# EAGLE design tinker (EAGLE 9.3.1)
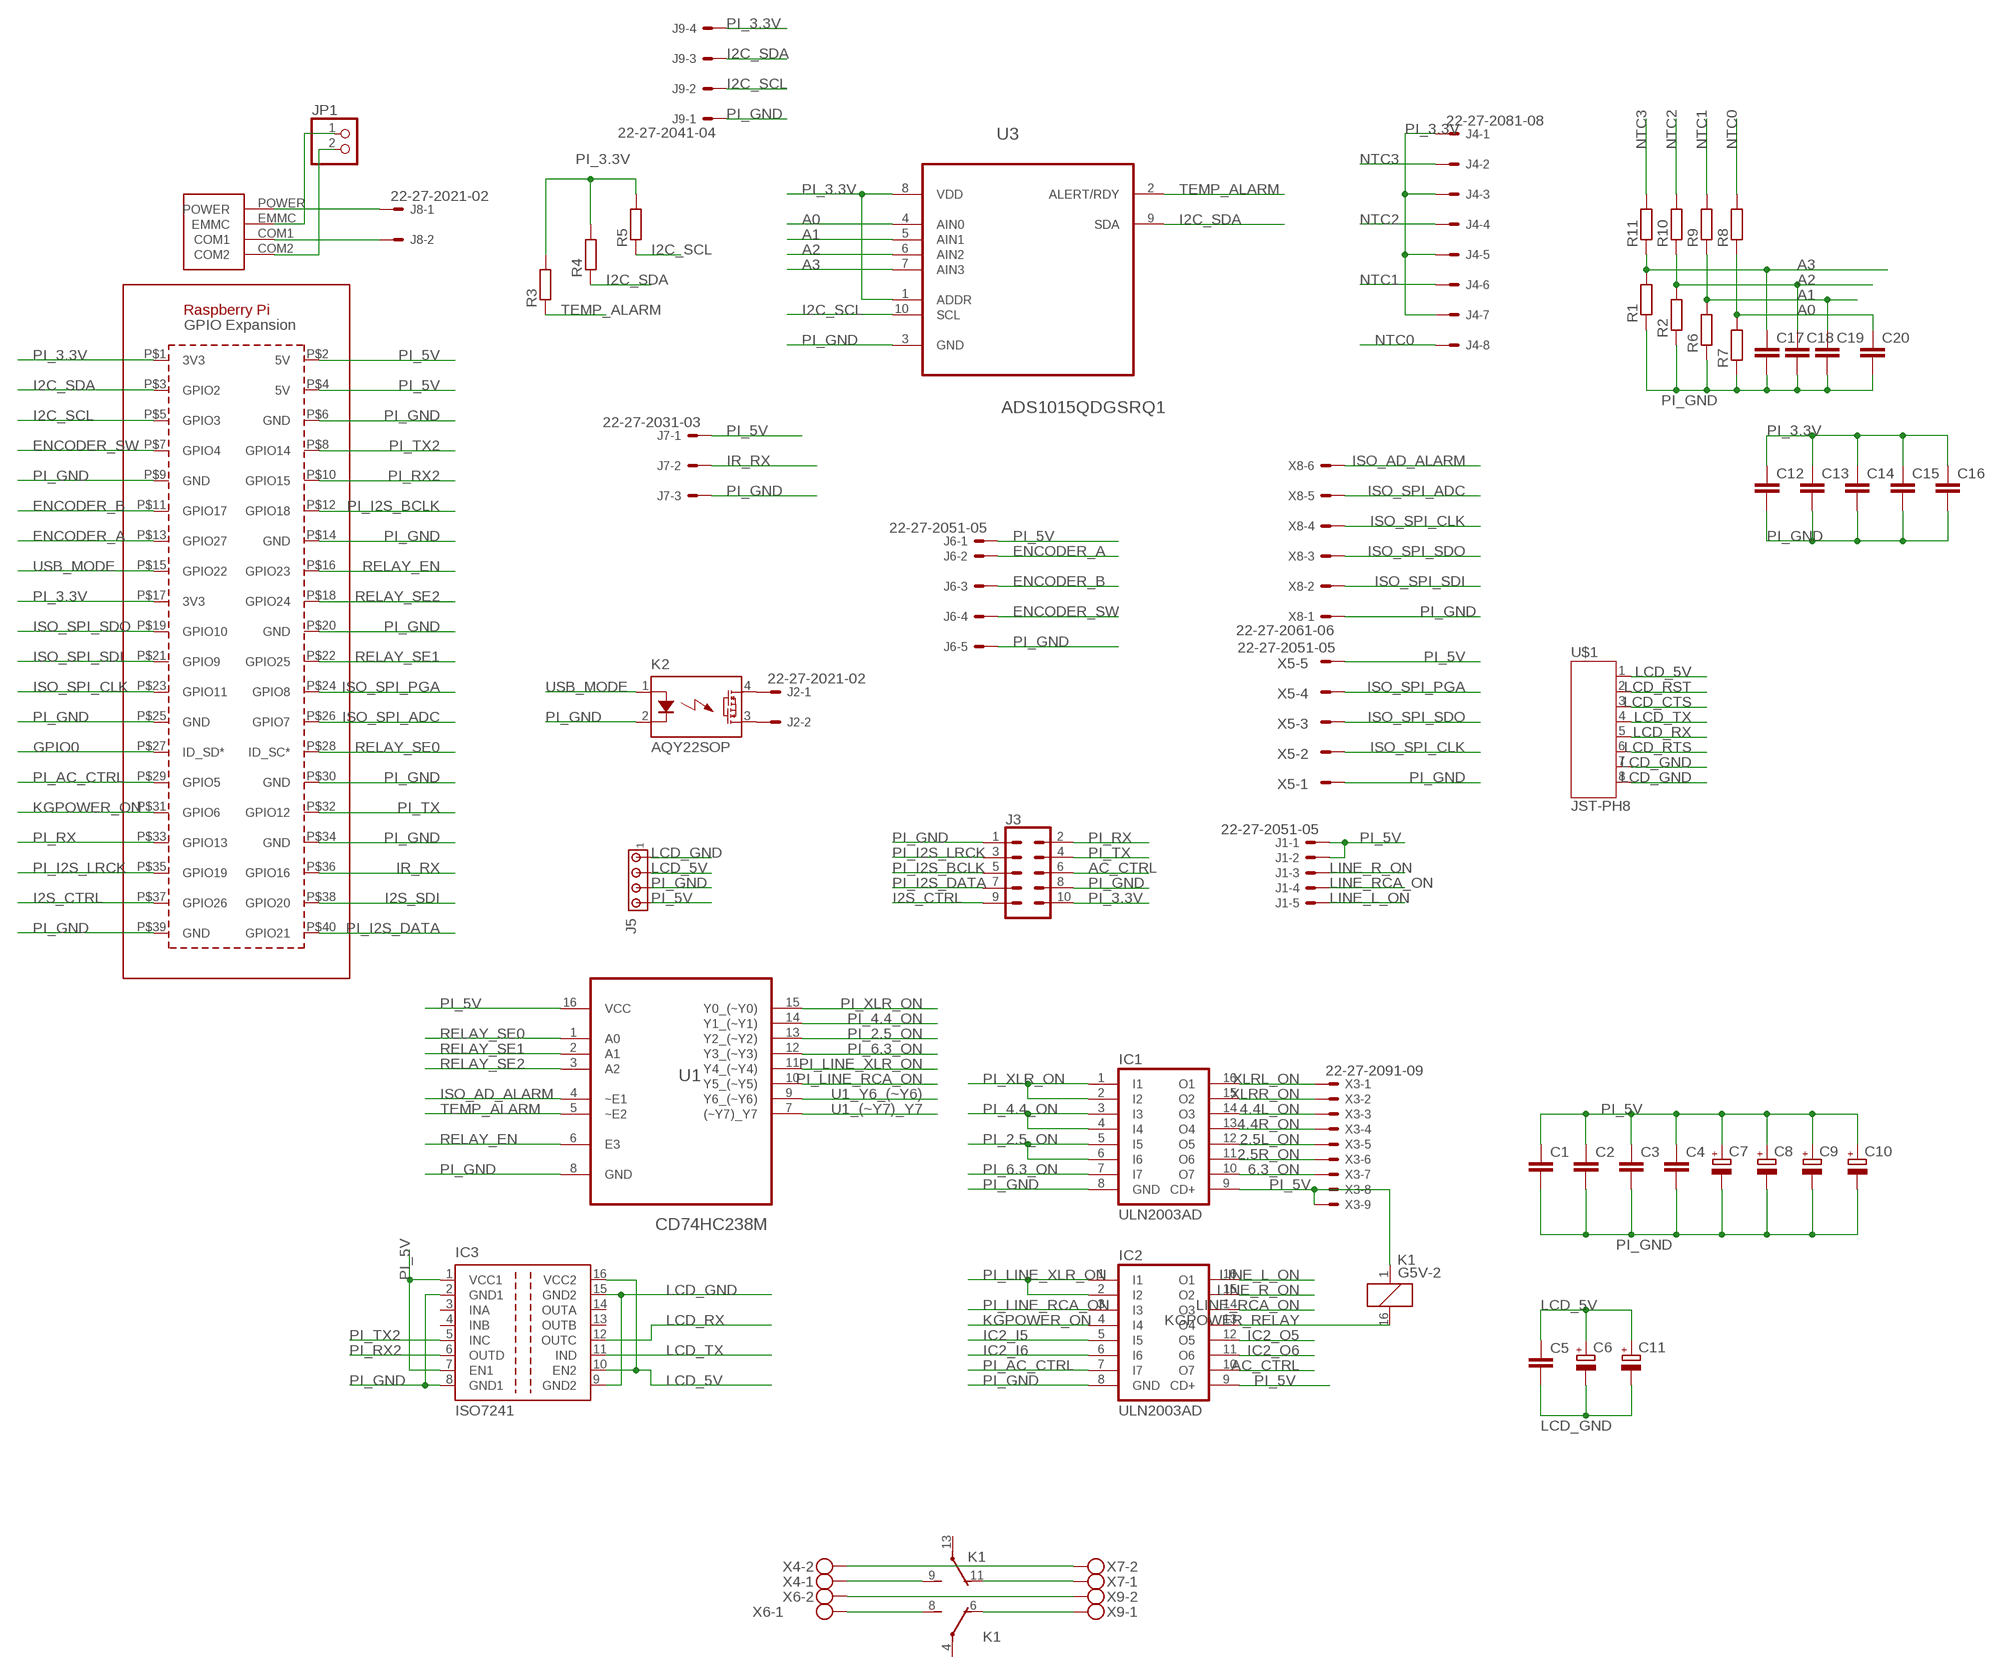
[diagram p0: schematic, sheet 1]

## Parts
C1  C-EUC0603  [C0603]
C2  C-EUC0603  [C0603]
C3  C-EUC0603  [C0603]
C4  C-EUC0603  [C0603]
C5  C-EUC0603  [C0603]
C6  CPOL-EUSP-CAP-CX  [SP-CAP-CX]
C7  CPOL-EUE5-10.5  [E5-10,5]
C8  CPOL-EUE5-10.5  [E5-10,5]
C9  CPOL-EUE5-10.5  [E5-10,5]
C10  CPOL-EUE5-10.5  [E5-10,5]
C11  CPOL-EUSP-CAP-CX  [SP-CAP-CX]
C12  C-EUC0603  [C0603]
C13  C-EUC0603  [C0603]
C14  C-EUC0603  [C0603]
C15  C-EUC0603  [C0603]
C16  C-EUC0603  [C0603]
C17  C-EUC0603  [C0603]
C18  C-EUC0603  [C0603]
C19  C-EUC0603  [C0603]
C20  C-EUC0603  [C0603]
IC1  ULN2003AD  [SO16]
IC2  ULN2003AD  [SO16]
IC3  ISO7241  [SO-16DW]
J1  22-27-2051-05  [6410-05]
J2  22-27-2021-02  [6410-02]
J3  CONN_05X2SHD_LOCK  [2X5-SHROUDED_LOCK]
J4  22-27-2081-08  [6410-08]
J5  MTA04-156  [1X4MTA]
J6  22-27-2051-05  [6410-05]
J7  22-27-2031-03  [6410-03]
J8  22-27-2021-02  [6410-02]
J9  22-27-2041-04  [6410-04]
JP1  PINHD-1X2  [1X02]
K1  G5V-2  [G5V-2]
K2  AQY22SOP  [SOP04]
PCB1  RPI3  [RPI3]
R1  R-EU_MELF0204W  [MINI_MELF-0204W]
R2  R-EU_MELF0204W  [MINI_MELF-0204W]
R3  R-EU_MELF0204W  [MINI_MELF-0204W]
R4  R-EU_MELF0204W  [MINI_MELF-0204W]
R5  R-EU_MELF0204W  [MINI_MELF-0204W]
R6  R-EU_MELF0204W  [MINI_MELF-0204W]
R7  R-EU_MELF0204W  [MINI_MELF-0204W]
R8  R-EU_MELF0204W  [MINI_MELF-0204W]
R9  R-EU_MELF0204W  [MINI_MELF-0204W]
R10  R-EU_MELF0204W  [MINI_MELF-0204W]
R11  R-EU_MELF0204W  [MINI_MELF-0204W]
U1  CD74HC238M  [SOIC127P600X175-16N]
U3  ADS1015QDGSRQ1  [SOP50P490X110-10N]
U$1  JST-PH8  [JST-PH8]
X3  22-27-2091-09  [6410-09]
X4  CON-PHOENIX-508_MKDSN1,5/2-5,08  [CON-PHOENIX-508_MKDSN1,5/2-5,08]
X5  22-27-2051-05  [6410-05]
X6  CON-PHOENIX-508_MKDSN1,5/2-5,08  [CON-PHOENIX-508_MKDSN1,5/2-5,08]
X7  CON-PHOENIX-508_MKDSN1,5/2-5,08  [CON-PHOENIX-508_MKDSN1,5/2-5,08]
X8  22-27-2061-06  [6410-06]
X9  CON-PHOENIX-508_MKDSN1,5/2-5,08  [CON-PHOENIX-508_MKDSN1,5/2-5,08]

## Nets
2.5L_ON: IC1.12(O5) X3.5
2.5R_ON: IC1.11(O6) X3.6
4.4L_ON: IC1.14(O3) X3.3
4.4R_ON: IC1.13(O4) X3.4
6.3_ON: IC1.10(O7) X3.7
A0: C20.1 R7.2 R8.1 U3.4(AIN0)
A1: C19.1 R6.2 R9.1 U3.5(AIN1)
A2: C18.1 R2.2 R10.1 U3.6(AIN2)
A3: C17.1 R1.2 R11.1 U3.7(AIN3)
AC_CTRL: IC2.10(O7) J3.6
ENCODER_A: J6.2 PCB1.P$13(GPIO27)
ENCODER_B: J6.3 PCB1.P$11(GPIO17)
ENCODER_SW: J6.4 PCB1.P$7(GPIO4)
GPIO0: PCB1.P$27(ID_SD*)
I2C_SCL: J9.2 PCB1.P$5(GPIO3) R5.1 U3.10(SCL)
I2C_SDA: J9.3 PCB1.P$3(GPIO2) R4.1 U3.9(SDA)
I2S_CTRL: J3.9 PCB1.P$37(GPIO26)
I2S_SDI: PCB1.P$38(GPIO20)
IC2_I5: IC2.5(I5)
IC2_I6: IC2.6(I6)
IC2_O5: IC2.12(O5)
IC2_O6: IC2.11(O6)
IR_RX: J7.2 PCB1.P$36(GPIO16)
ISO_AD_ALARM: U1.4(~E1) X8.6
ISO_SPI_ADC: PCB1.P$26(GPIO7) X8.5
ISO_SPI_CLK: PCB1.P$23(GPIO11) X5.2 X8.4
ISO_SPI_PGA: PCB1.P$24(GPIO8) X5.4
ISO_SPI_SDI: PCB1.P$21(GPIO9) X8.2
ISO_SPI_SDO: PCB1.P$19(GPIO10) X5.3 X8.3
KGPOWER_ON: IC2.4(I4) PCB1.P$31(GPIO6)
KGPOWER_RELAY: IC2.13(O4) K1.16
LCD_5V: C5.1 C6.+ C11.+ IC3.10(EN2) IC3.16(VCC2) J5.2 U$1.1
LCD_CTS: U$1.3
LCD_GND: C5.2 C6.- C11.- IC3.9(GND2) IC3.15(GND2) J5.1 U$1.7 U$1.8
LCD_RST: U$1.2
LCD_RTS: U$1.6
LCD_RX: IC3.12(OUTC) U$1.5
LCD_TX: IC3.11(IND) U$1.4
LINE_L_ON: IC2.16(O1) J1.5
LINE_R_ON: IC2.15(O2) J1.3
LINE_RCA_ON: IC2.14(O3) J1.4
N$1: K1.8(1:S) X6.1
N$2: K1.6(1:O) X9.1
N$3: K1.11(2:O) X7.1
N$4: K1.9(2:S) X4.1
N$5: X6.2 X9.2
N$6: X4.2 X7.2
N$7: J2.1 K2.4(DS1)
N$8: J2.2 K2.3(DS2)
N$10: J8.1 PCB1.POWER
N$11: J8.2 PCB1.COM1
N$12: JP1.1 PCB1.EMMC
N$13: JP1.2 PCB1.COM2
NTC0: J4.8 R8.2
NTC1: J4.6 R9.2
NTC2: J4.4 R10.2
NTC3: J4.2 R11.2
PI_2.5_ON: IC1.5(I5) IC1.6(I6) U1.13(Y2_(~Y2))
PI_3.3V: C12.1 C13.1 C14.1 C15.1 C16.1 J3.10 J4.1 J4.3 J4.5 J4.7 J9.4 PCB1.P$1(3V3) PCB1.P$17(3V3) R3.2 R4.2 R5.2 U3.1(ADDR) U3.8(VDD)
PI_4.4_ON: IC1.3(I3) IC1.4(I4) U1.14(Y1_(~Y1))
PI_5V: C1.1 C2.1 C3.1 C4.1 C7.+ C8.+ C9.+ C10.+ IC1.9(CD+) IC2.9(CD+) IC3.1(VCC1) IC3.7(EN1) J1.1 J1.2 J5.4 J6.1 J7.1 K1.1 PCB1.P$2(5V) PCB1.P$4(5V) U1.16(VCC) X3.8 X3.9 X5.5
PI_6.3_ON: IC1.7(I7) U1.12(Y3_(~Y3))
PI_AC_CTRL: IC2.7(I7) PCB1.P$29(GPIO5)
PI_GND: C1.2 C2.2 C3.2 C4.2 C7.- C8.- C9.- C10.- C12.2 C13.2 C14.2 C15.2 C16.2 C17.2 C18.2 C19.2 C20.2 IC1.8(GND) IC2.8(GND) IC3.2(GND1) IC3.8(GND1) J3.1 J3.8 J5.3 J6.5 J7.3 J9.1 K2.2(K) PCB1.P$6(GND) PCB1.P$9(GND) PCB1.P$14(GND) PCB1.P$20(GND) PCB1.P$25(GND) PCB1.P$30(GND) PCB1.P$34(GND) PCB1.P$39(GND) R1.1 R2.1 R6.1 R7.1 U1.8(GND) U3.3(GND) X5.1 X8.1
PI_I2S_BCLK: J3.5 PCB1.P$12(GPIO18)
PI_I2S_DATA: J3.7 PCB1.P$40(GPIO21)
PI_I2S_LRCK: J3.3 PCB1.P$35(GPIO19)
PI_LINE_RCA_ON: IC2.3(I3) U1.10(Y5_(~Y5))
PI_LINE_XLR_ON: IC2.1(I1) IC2.2(I2) U1.11(Y4_(~Y4))
PI_RX: J3.2 PCB1.P$33(GPIO13)
PI_RX2: IC3.6(OUTD) PCB1.P$10(GPIO15)
PI_TX: J3.4 PCB1.P$32(GPIO12)
PI_TX2: IC3.5(INC) PCB1.P$8(GPIO14)
PI_XLR_ON: IC1.1(I1) IC1.2(I2) U1.15(Y0_(~Y0))
RELAY_EN: PCB1.P$16(GPIO23) U1.6(E3)
RELAY_SE0: PCB1.P$28(ID_SC*) U1.1(A0)
RELAY_SE1: PCB1.P$22(GPIO25) U1.2(A1)
RELAY_SE2: PCB1.P$18(GPIO24) U1.3(A2)
TEMP_ALARM: R3.1 U1.5(~E2) U3.2(ALERT/RDY)
U1_(~Y7)_Y7: U1.7((~Y7)_Y7)
U1_Y6_(~Y6): U1.9(Y6_(~Y6))
USB_MODE: K2.1(A) PCB1.P$15(GPIO22)
XLRL_ON: IC1.16(O1) X3.1
XLRR_ON: IC1.15(O2) X3.2
Unconnected: IC3.3(INA) IC3.4(INB) IC3.13(OUTB) IC3.14(OUTA) K1.4(1:P) K1.13(2:P)

## Library data of the parts
C1-C5 C12-C20 = Vwvwbg:C-EU: CAPACITOR, European symbol
C6-C11 = Vwvwbg:CPOL-EU: POLARIZED CAPACITOR, European symbol
IC1 IC2 = uln-udn:ULN2003A: DRIVER ARRAY
IC3 = texas:ISO7241: HIGH SPEED QUAD DIGITAL ISOLATORS Source: http://focus.ti.com/lit/ds/symlink/iso7240m.pdf; MPN: ISO7241CDW; OC_FARNELL: 1575372; OC_NEWARK: 73M3155
J1 J6 X5 = con-molex:22-?-05: CONNECTOR wire to board 2.54 mm (.1 inch) pitch header; MF: MOLEX; OC_FARNELL: unknown; OC_NEWARK: unknown
J2 J8 = con-molex:22-?-02: CONNECTOR wire to board 2.54 mm (.1 inch) pitch header; MF: MOLEX; OC_FARNELL: unknown; OC_NEWARK: unknown
J3 = SparkFun-Connectors:CONN_05X2: Multi connection point. Often used as Generic Header-pin footprint for 0.1 inch spaced/style header connections For AVR SPI programming port, see special device with nice symbol: "AVR_SPI_PROG_5x2.dev" You can populate with any combo of single row headers, but if you'd like an exact match, check these: 2x5 AVR ICSP Male Header <https://www.sparkfun.com/products/778> (PRT-00778) 2x5 Pin Shrouded Header <https://www.sparkfun.com/products/8506> (PRT-08506) On any of the 0.1 inch spaced packages, you can populate with these: Break Away Headers - Straight <https://www.sparkfun.com/products/116> (PRT-00116) Break Away Male Headers - Right Angle <https://www.sparkfun.com/products/553> (PRT-00553) Female Headers <https://www.sparkfun.com/products/115> (PRT-00115) Break Away Headers - Machine Pin <https://www.sparkfun.com/products/117> (PRT-00117) Break Away Female Headers - Swiss Machine Pin <https://www.sparkfun.com/products/743> (PRT-00743) Special note: the shrouded connector mates well with our 5x2 ribbon cables: 2x5 Pin IDC Ribbon Cable <https://www.sparkfun.com/products/8535> (PRT-08535); PROD_ID: CONN-08671; SF_ID: PRT-08506
J4 = con-molex:22-?-08: CONNECTOR wire to board 2.54 mm (.1 inch) pitch header; MF: MOLEX; OC_FARNELL: unknown; OC_NEWARK: unknown
J5 = con-amp:MTA04-156: AMP connector
J7 = con-molex:22-?-03: CONNECTOR wire to board 2.54 mm (.1 inch) pitch header; MF: MOLEX; OC_FARNELL: unknown; OC_NEWARK: unknown
J9 = con-molex:22-?-04: CONNECTOR wire to board 2.54 mm (.1 inch) pitch header; MF: MOLEX; OC_FARNELL: unknown; OC_NEWARK: unknown
JP1 = pinhead:PINHD-1X2: PIN HEADER
K1 = relay:G5V-2: OMRON PCB Relay Source: http://www.omron.com/ecb/products/pdf/en-g5v2.pdf; MPN: G5V-2 5DC; OC_FARNELL: 9949488; OC_NEWARK: 78K5703
K2 = relay:AQY*: PhotoMOS Relay NAiS Source: http://www.panasonic-electric-works.com/catalogues/downloads/photomos/ds_x615_en_aqz10_20.pdf; OC_FARNELL: unknown; OC_NEWARK: unknown
PCB1 = e14_Rpi3_RevA:RPI3: Device for Raspberry Pi 3 board created by Dave Young for www.element14.com More information and support community is available at https://www.element14.com/community/community/raspberry-pi
R1-R11 = Vwvwbg:R-EU_: RESISTOR, European symbol
U1 = Texas Instruments_By_element14_Batch_1:CD74HC238M: High-Speed CMOS Logic 3- to 8-Line Decoder/Demultiplexer Inverting and Noninverting; MPN: CD74HC238M; OC_FARNELL: 1640756; OC_NEWARK: 66F5206; PACKAGE: SOIC-16; SUPPLIER: Texas Instruments
U3 = Texas Instruments_By_element14_Batch_1:ADS1015QDGSRQ1: ADC; MPN: ADS1015QDGSRQ1; OC_FARNELL: -; OC_NEWARK: 99R9767; PACKAGE: MSOP-10; SUPPLIER: Texas Instruments
U$1 = jst-ph:JST-PH8
X3 = con-molex:22-?-09: CONNECTOR wire to board 2.54 mm (.1 inch) pitch header; MF: MOLEX; OC_FARNELL: unknown; OC_NEWARK: unknown
X4 X6 X7 X9 = Vwvwbg:CON-PHOENIX-508_MKDSN1,5/2-5,08: MKDSN 1,5/ 2-5,08 Printklemme Nennstrom: 13,5 A Nennspannung: 250 V Rastermaß: 5,08 mm Polzahl: 2 Anschlussart: Schraubanschluss Montage: Löten Anschlussrichtung Leiter/Platine: 0 ° Artikelnummer: 1729128 Source: http://eshop.phoenixcontact.com .. 1729128.pdf
X8 = con-molex:22-?-06: CONNECTOR wire to board 2.54 mm (.1 inch) pitch header; MF: MOLEX; OC_FARNELL: unknown; OC_NEWARK: unknown

## Board
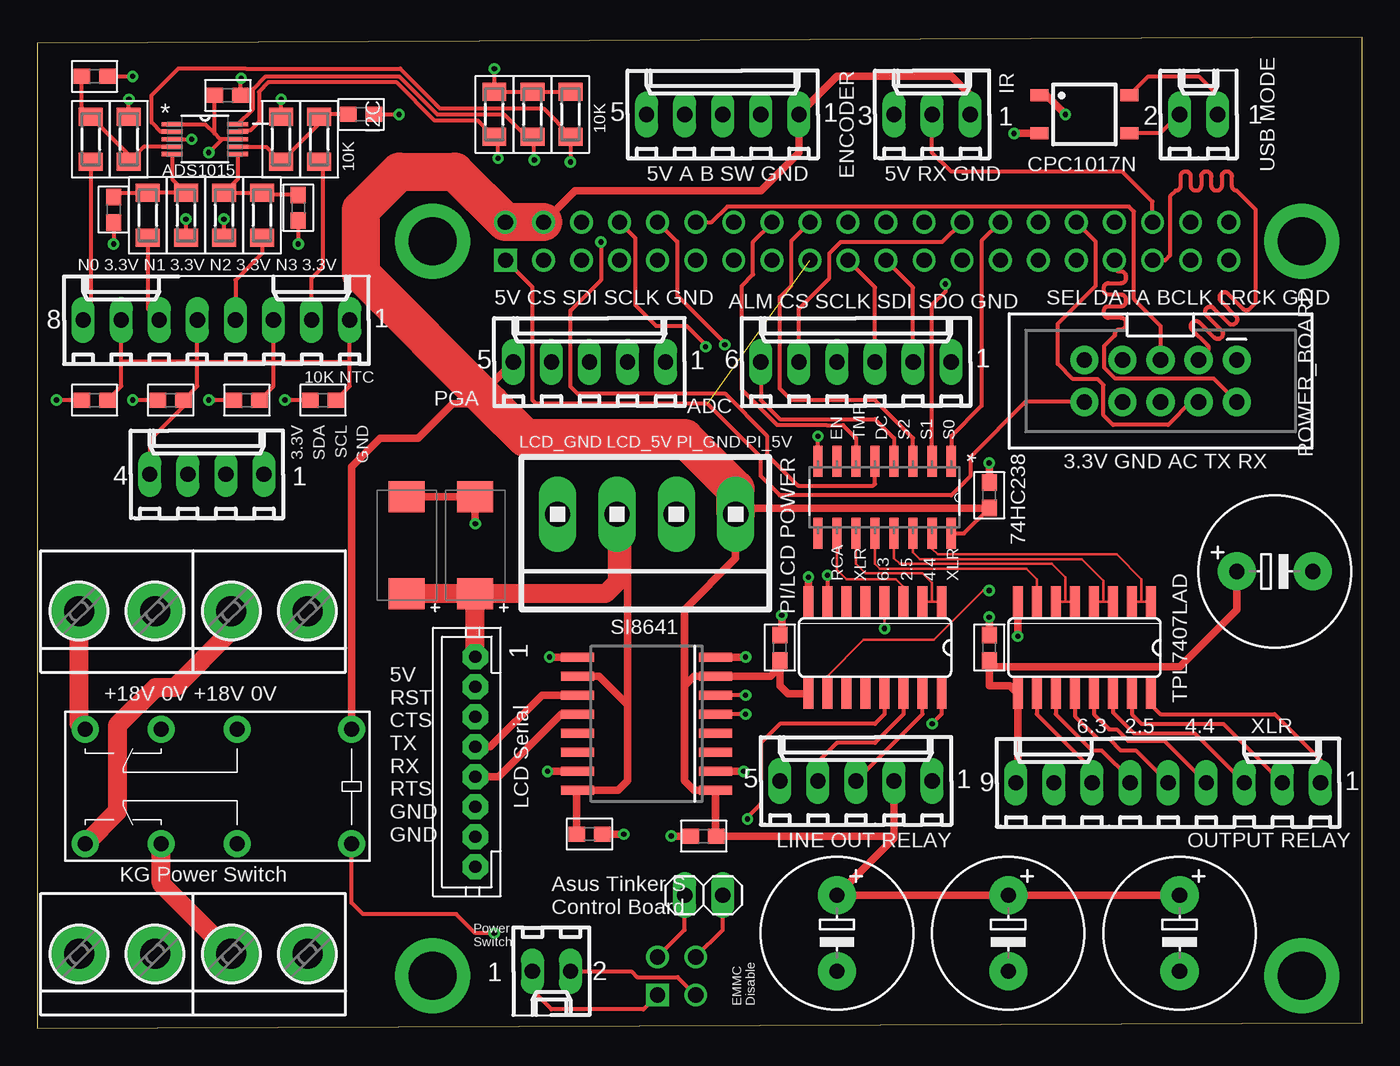
[diagram p1: board, top side]
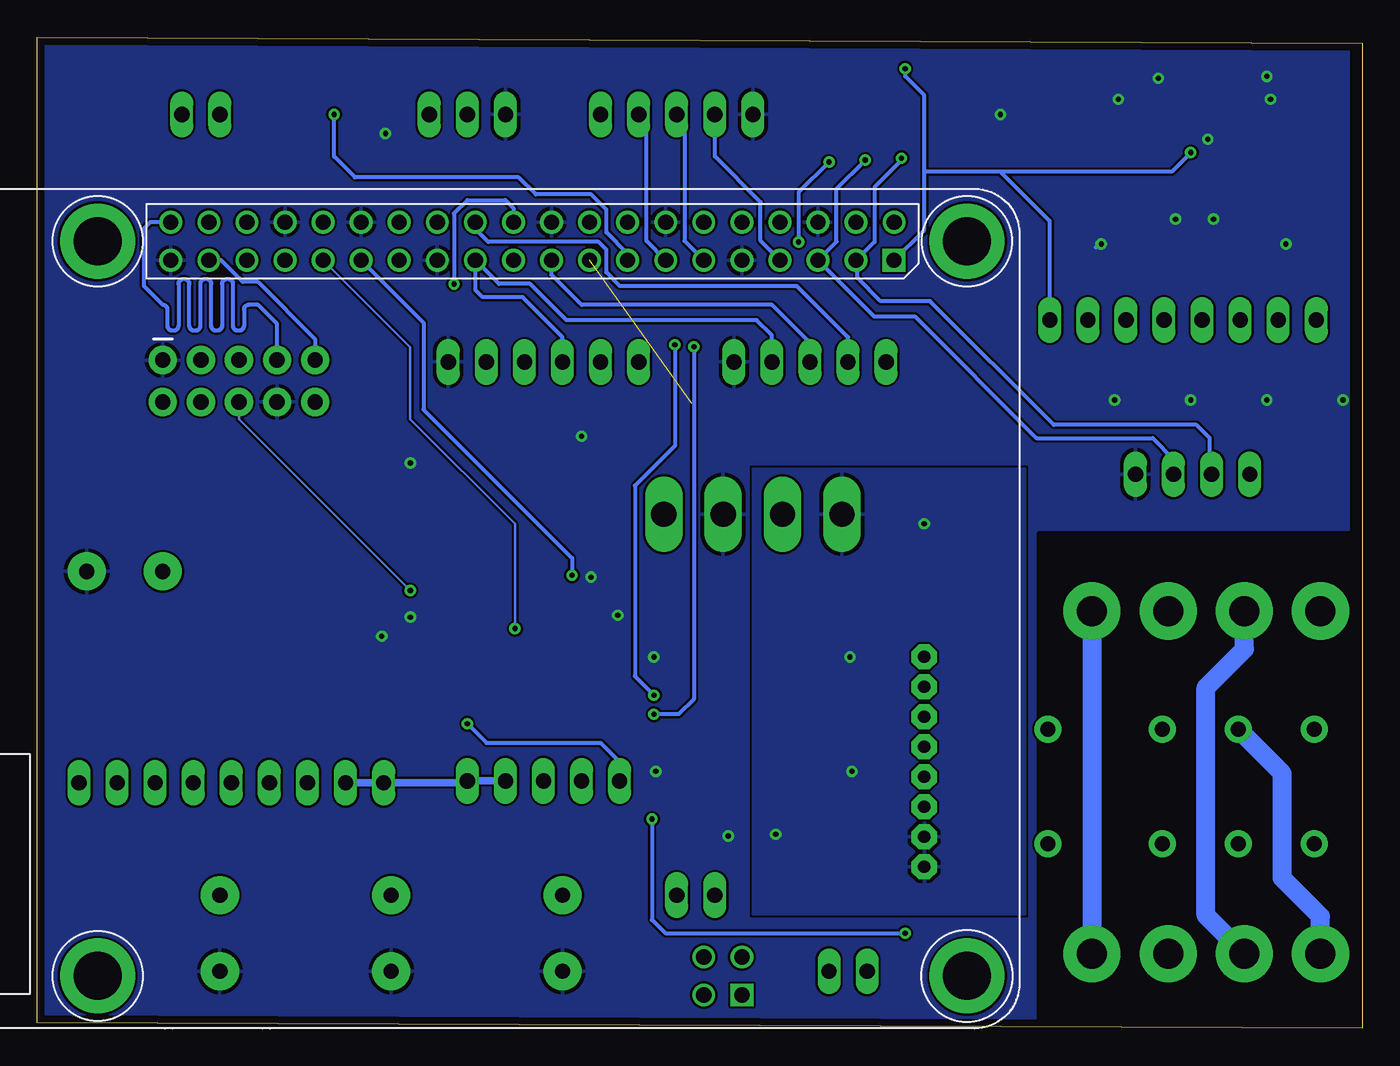
[diagram p2: board, bottom side, seen from below]

Size 88.37 x 66.09 mm. Coordinates in mm from the lower left corner, seen from the top.
Outline: 0,0 88.37,0.38 88.37,66.09 0,65.71 0,0
Copper layers (1*16): Top 0.035mm / dielectric 1.5mm / Bottom 0.035mm
Design rules "default *": minimum track width 6mil, minimum drill 0.35mm, track to track 6mil, track to pad 6mil, pad to pad 6mil, via to via 6mil, smd to smd 6mil, copper to edge 20mil, drill to drill 6mil, minimum pad ring 10mil, minimum via ring 8mil, stop-mask expansion 4mil, vias tented up to drill 0.36mm, thermal gap 10mil

### Footprints (pad centres in the part's own frame; a part is rotated, then mirrored left to right if it is on the bottom)
C0603 = smd 1.1 x 1: 1 -0.85,0; 2 0.85,0
SP-CAP-CX = smd 2.062 x 2.4: + -2.754,0; - 3.707,0
E5-10,5 = drill 1.016 pad 2.54: + -2.54,0; - 2.54,0
SO16 = smd 0.66 x 2.032: 1 -4.445,-3.073; 2 -3.175,-3.073; 3 -1.905,-3.073; 4 -0.635,-3.073; 5 0.635,-3.073; 6 1.905,-3.073; 7 3.175,-3.073; 8 4.445,-3.073; 9 4.445,3.073; 10 3.175,3.073; 11 1.905,3.073; 12 0.635,3.073; 13 -0.635,3.073; 14 -1.905,3.073; 15 -3.175,3.073; 16 -4.445,3.073
SO-16DW = smd 0.6 x 2.2: 1 -4.445,-4.6; 2 -3.175,-4.6; 3 -1.905,-4.6; 4 -0.635,-4.6; 5 0.635,-4.6; 6 1.905,-4.6; 7 3.175,-4.6; 8 4.445,-4.6; 9 4.445,4.6; 10 3.175,4.6; 11 1.905,4.6; 12 0.635,4.6; 13 -0.635,4.6; 14 -1.905,4.6; 15 -3.175,4.6; 16 -4.445,4.6
6410-05 = drill 1.016 long: 1 5.08,0; 2 2.54,0; 3 0,0; 4 -2.54,0; 5 -5.08,0
6410-02 = drill 1.016 long: 1 1.27,0; 2 -1.27,0
2X5-SHROUDED_LOCK = drill 1.016 pad 1.88: 1 -1.397,5.08; 2 1.397,5.08; 3 -1.397,2.54; 4 1.397,2.54; 5 -1.397,0; 6 1.397,0; 7 -1.397,-2.54; 8 1.397,-2.54; 9 -1.397,-5.08; 10 1.397,-5.08
6410-08 = drill 1.016 long: 1 8.89,0; 2 6.35,0; 3 3.81,0; 4 1.27,0; 5 -1.27,0; 6 -3.81,0; 7 -6.35,0; 8 -8.89,0
1X4MTA = drill 1.676 long: 1 5.944,0; 2 1.981,0; 3 -1.981,0; 4 -5.944,0
6410-03 = drill 1.016 long: 1 2.54,0; 2 0,0; 3 -2.54,0
6410-04 = drill 1.016 long: 1 3.81,0; 2 1.27,0; 3 -1.27,0; 4 -3.81,0
1X02 = drill 1.016 long: 1 -1.27,0; 2 1.27,0
G5V-2 = drill 1 pad 1.8: 1 -8.89,-3.81; 4 -1.27,-3.81; 6 3.81,-3.81; 8 8.89,-3.81; 9 8.89,3.81; 11 3.81,3.81; 13 -1.27,3.81; 16 -8.89,3.81
SOP04 = smd 0.8 x 1.2: 1 -1.27,-3; 2 1.27,-3; 3 1.27,3; 4 -1.27,3
RPI3 = drill 1.016: COM1 21.057,2.228; COM2 21.057,4.768; EMMC 18.517,4.768; P$2 8.357,53.772; P$3 10.897,51.232; P$4 10.897,53.772; P$5 13.437,51.232; P$6 13.437,53.772; P$7 15.977,51.232; P$8 15.977,53.772; P$9 18.517,51.232; P$10 18.517,53.772; P$11 21.057,51.232; P$12 21.057,53.772; P$13 23.597,51.232; P$14 23.597,53.772; P$15 26.137,51.232; P$16 26.137,53.772; P$17 28.677,51.232; P$18 28.677,53.772; P$19 31.217,51.232; P$20 31.217,53.772; P$21 33.757,51.232; P$22 33.757,53.772; P$23 36.297,51.232; P$24 36.297,53.772; P$25 38.837,51.232; P$26 38.837,53.772; P$27 41.377,51.232; P$28 41.377,53.772; P$29 43.917,51.232; P$30 43.917,53.772; P$31 46.457,51.232; P$32 46.457,53.772; P$33 48.997,51.232; P$34 48.997,53.772; P$35 51.537,51.232; P$36 51.537,53.772; P$37 54.077,51.232; P$38 54.077,53.772; P$39 56.617,51.232; P$40 56.617,53.772 | drill 1.016 square: P$1 8.37,51.23; POWER 18.517,2.228 | drill 3.2 pad 5: P$41 3.5,3.5; P$42 61.5,3.5; P$43 3.5,52.5; P$44 61.5,52.5
MINI_MELF-0204W = smd 1.2 x 1.6: 1 -1.5,0; 2 1.5,0
SOIC127P600X175-16N = smd 2.057 x 0.61: 1 -4.801,8.89; 2 -4.801,7.62; 3 -4.801,6.35; 4 -4.801,5.08; 5 -4.801,3.81; 6 -4.801,2.54; 7 -4.801,1.27; 8 -4.801,0; 9 0,0; 10 0,1.27; 11 0,2.54; 12 0,3.81; 13 0,5.08; 14 0,6.35; 15 0,7.62; 16 0,8.89
SOP50P490X110-10N = smd 1.422 x 0.279: 1 -2.184,0.991; 2 -2.184,0.508; 3 -2.184,0; 4 -2.184,-0.508; 5 -2.184,-0.991; 6 2.184,-0.991; 7 2.184,-0.508; 8 2.184,0; 9 2.184,0.508; 10 2.184,0.991
JST-PH8 = drill 0.813 pad 1.676 octagon: 1 7,0; 2 5,0; 3 3,0; 4 1,0; 5 -1,0; 6 -3,0; 7 -5,0; 8 -7,0
6410-09 = drill 1.016 long: 1 10.16,0; 2 7.62,0; 3 5.08,0; 4 2.54,0; 5 0,0; 6 -2.54,0; 7 -5.08,0; 8 -7.62,0; 9 -10.16,0
CON-PHOENIX-508_MKDSN1,5/2-5,08 = drill 2 pad 3.81: 1 -2.561,0.025; 2 2.519,0.025
6410-06 = drill 1.016 long: 1 6.35,0; 2 3.81,0; 3 1.27,0; 4 -1.27,0; 5 -3.81,0; 6 -6.35,0

### Placement (x,y rotation side)
C1  63.5,25.4 90 top
C2  49.53,25.4 90 top
C3  63.5,35.56 90 top
C4  44.45,12.83 180 top
C5  36.83,12.95 0 top
C6  29.21,31.75 90 top
C7  82.55,30.48 0 top
C8  53.34,6.35 270 top
C9  76.2,6.35 270 top
C10  64.77,6.35 270 top
C11  24.64,31.75 90 top
C12  12.7,62.23 0 top
C13  3.81,41.91 180 top
C14  8.89,41.91 180 top
C15  13.97,41.91 180 top
C16  19.05,41.91 180 top
C17  21.59,60.96 0 top
C18  17.4,54.74 270 top
C19  5.08,54.61 270 top
C20  3.81,63.5 0 top
IC1  69.85,25.4 180 top
IC2  55.88,25.4 180 top
IC3  40.64,20.32 90 top
J1  54.61,16.51 0 top
J2  77.47,60.96 0 top
J3  74.93,43.18 270 top
J4  11.94,47.24 0 top
J5  40.64,34.29 180 top
J6  45.72,60.96 0 top
J7  59.69,60.96 0 top
J8  34.29,3.81 180 top
J9  11.3,36.96 0 top
JP1  44.45,8.89 0 top
K1  12.07,16.13 180 top
K2  69.85,60.96 270 top
PCB1  22.86,0 0 top
R1  16.26,59.31 270 top
R2  12.45,54.23 90 top
R3  35.56,60.96 90 top
R4  30.48,60.96 90 top
R5  33.02,60.96 90 top
R6  9.91,54.23 90 top
R7  6.1,59.31 270 top
R8  3.56,59.31 270 top
R9  7.37,54.23 270 top
R10  14.99,54.23 270 top
R11  18.8,59.31 270 top
U1  52.07,33.02 270 top
U3  11.18,59.31 0 top
U$1  29.21,17.78 90 top
X3  75.44,16.38 0 top
X4  15.49,27.81 0 top
X5  36.83,44.45 0 top
X6  5.33,27.81 0 top
X7  15.49,4.95 0 top
X8  54.61,44.45 0 top
X9  5.33,4.95 0 top

### Tracks (layer width: path | path; a pad name or v marks a point on that pad's centre or on a via)
2.5L_ON
  Top 0.254: IC1.12 69.22,20.83 70.74,19.3 71.5,19.3 72.26,18.54 73.28,18.54 X3.5
2.5R_ON
  Top 0.254: IC1.11 67.95,20.95 70.36,18.54 70.99,18.54 72.9,16.64 X3.6
4.4L_ON
  Top 0.254: IC1.14 71.76,21.08 73.15,19.68 77.22,19.68 X3.3
4.4R_ON
  Top 0.254: IC1.13 70.48,20.95 71.5,19.94 72.01,19.94 72.77,19.18 75.18,19.18 X3.4
6.3_ON
  Top 0.254: IC1.10 66.68,20.95 70.36,17.27 X3.7
A0
  Top 0.254: U3.4 7.09,58.8 R7.2 6.1,58.27 R8.1 2.96,61.41 C20.1
A1
  Top 0.254: U3.5 8.99,56.64 R6.2 7.62,55.73 R9.1 5.35,55.73 C19.1
A2
  Top 0.254: U3.6 13.36,56.64 R2.2 R10.1 15.13,55.59 C18.1
A3
  Top 0.254: U3.7 15.26,58.8 R1.2 18.8,60.35 R11.1 18.95,60.96 C17.1
AC_CTRL  (via drill 0.35)
  Top 0.152: IC2.10 52.7,23.5 55.12,25.91 59.82,25.91 63.12,29.21 v63.5,29.21
  Bottom 0.152: J3.6 74.93,40.64 v63.5,29.21
ENCODER_A
  Bottom 0.254: PCB1.P$13 47.75,52.53 47.75,60.45 J6.2
ENCODER_B
  Bottom 0.254: J6.3 45.21,60.45 45.21,52.53 PCB1.P$11
ENCODER_SW
  Bottom 0.254: PCB1.P$7 40.13,52.53 40.13,55.12 43.18,58.17 J6.4
I2C_SCL  (via drill 0.35)
  Top 0.254: U3.10 14.38,61.32 14.38,62.64 15.24,63.5 24.13,63.5 26.67,60.96 31.11,60.96 32.62,59.46 R5.1 33.15,59.33 v33.15,57.91
  Bottom 0.254: v33.15,57.91 35.05,56.01 35.05,52.48 PCB1.P$5 32.56,47.5 29.84,47.5 21.72,39.37 13.97,39.37 12.57,37.97 J9.2
I2C_SDA  (via drill 0.35)
  Top 0.254: U3.9 13.42,59.88 14.19,59.88 14.79,60.48 14.79,62.47 15.41,63.09 23.96,63.09 26.5,60.55 29.39,60.55 R4.1 30.73,59.21 v30.73,58.04
  Bottom 0.254: PCB1.P$3 33.67,51.32 | 33.67,51.32 32.54,52.45 32.51,52.45 32.51,56.13 30.73,57.91 v30.73,58.04 | J9.3 10.16,37.08 10.16,39.37 11.05,40.26 20.57,40.26 28.83,48.51 32.13,48.51 33.67,50.05 33.67,51.32
I2S_CTRL
  Bottom 0.254: J3.9 69.85,45.97 73.66,49.78 74.68,49.78 76.12,51.23 PCB1.P$37
IR_RX
  Top 0.254: PCB1.P$36 74.4,55.14 72.39,57.15 60.96,57.15 59.69,58.42 J7.2
ISO_AD_ALARM
  Top 0.254: X8.6 48.26,41.91 49.53,40.64 55.88,40.64 57.15,39.37 U1.4
ISO_SPI_ADC
  Top 0.254: PCB1.P$26 60.38,52.45 53.59,52.45 52.83,51.69 52.83,50.04 50.8,48.01 X8.5
ISO_SPI_CLK
  Bottom 0.254: X5.2 39.37,46.23 40.39,47.24 53.09,47.24 55.5,49.66 57.58,49.66 59.14,51.22 | 59.14,51.22 PCB1.P$23 | X8.4 53.34,46.1 56.01,48.77 58.67,48.77 59.14,49.24 59.14,51.22
ISO_SPI_PGA
  Bottom 0.254: X5.4 34.29,46.1 37.72,49.53 49.53,49.53 50.42,50.42 50.42,51.94 50.93,52.45 58.29,52.45 59.16,53.31 PCB1.P$24
ISO_SPI_SDI
  Top 0.254: X8.2 58.42,49.43 PCB1.P$21
ISO_SPI_SDO
  Top 0.254: PCB1.P$19 55.88,49.43 X8.3
  Bottom 0.254: X5.3 36.83,45.72 39.37,48.26 52.07,48.26 54.08,50.27 PCB1.P$19
KGPOWER_ON  (via drill 0.35)
  Top 0.152: v56.52,26.67 IC2.4
  Bottom 0.152: PCB1.P$31 63.5,45.41 63.5,40.64 56.52,33.66 v56.52,26.67
KGPOWER_RELAY  (via drill 0.35)
  Top 0.254: IC2.13 56.52,20.95 55.88,20.32 49.53,20.32 48.26,19.05 48.26,14.99 47.37,14.1 v47.37,13.97 | v30.48,6.35 29.21,6.35 27.94,7.62 21.72,7.62 20.95,8.38 K1.16
  Bottom 0.254: v47.37,13.97 47.37,7.24 46.48,6.35 v30.48,6.35
LCD_5V
  Top 0.508: 39.37,21.59 39.37,16.51 38.73,15.88 IC3.16 35.98,15.81 C5.1 | 39.37,21.59 37.46,23.5 IC3.10 | J5.2 39.37,33.58 39.37,21.59
  Top 1.27: J5.2 38.66,29.77 37.89,29 C6.+ | C6.+ C11.+ | U$1.1 C6.+
LCD_GND  (via drill 0.35)
  Top 0.508: IC3.9 v34.16,24.77 | IC3.15 v34.04,17.14 | C5.2 v39.12,12.95 | v29.21,33.66 C6.- C11.-
  pour Bottom: 22.48,37.34 40.64,37.34 40.64,7.62 22.48,7.62
LCD_RX
  Top 0.508: U$1.5 30.75,16.78 34.92,20.95 IC3.12
LCD_TX
  Top 0.508: IC3.11 33.66,22.23 30.21,18.78 U$1.4
LINE_L_ON  (via drill 0.35)
  Top 0.254: IC2.16 60.32,20.95 v59.69,20.32
  Bottom 0.254: v59.69,20.32 58.42,19.05 50.8,19.05 49.53,17.78 J1.5
LINE_R_ON
  Top 0.254: J1.3 59.05,20.95 IC2.15
LINE_RCA_ON
  Top 0.254: IC2.14 57.78,20.95 55.88,19.05 53.34,19.05 52.07,17.78 J1.4
N$1
  Top 1.27: K1.8 2.77,20.34 X6.1
N$2
  Bottom 1.27: X9.1 2.77,7.47 5.33,10.03 5.33,17.02 K1.6
N$3
  Top 1.27: X7.1 8.25,9.66 K1.11
N$4
  Top 1.27: X4.1 12.93,26.52 9.14,22.73 7.87,22.73 5.33,20.19 5.33,14.48 K1.9
N$5
  Bottom 1.27: X9.2 10.41,7.54 10.41,22.73 7.85,25.29 X6.2
N$6
  Bottom 1.27: X4.2 X7.2
N$7
  Top 0.254: K2.4 74.12,63.5 77.47,63.5 78.74,62.23 J2.1
N$8
  Top 0.254: J2.2 74.93,59.69 K2.3
N$9
  cutout Bottom: -1.27,33.02 21.59,33.02 21.59,0 -1.27,0
N$10
  Top 0.254: PCB1.POWER 40.42,1.27 34.29,1.27 33.02,2.54 J8.1
N$11
  Top 0.254: J8.2 39.62,3.81 40.01,3.43 42.72,3.43 PCB1.COM1
N$12
  Top 0.254: PCB1.EMMC 43.18,6.57 JP1.1
N$13
  Top 0.254: PCB1.COM2 45.72,6.57 JP1.2
NTC0
  Top 0.254: R8.2 3.56,47.75 J4.8
NTC1
  Top 0.254: R9.2 7.37,48.01 J4.6
NTC2
  Top 0.254: R10.2 14.99,51.69 13.21,49.91 J4.4
NTC3
  Top 0.254: J4.2 18.29,50.04 19.05,50.8 19.05,57.55 R11.2
PI_2.5_ON
  Top 0.152: 68.58,28.45 68.58,30.1 67.69,30.99 57.53,30.99 57.15,31.37 U1.13 | 68.58,28.45 67.97,28.45 IC1.6 | 68.58,28.45 69.19,28.45 IC1.5
PI_3.3V  (via drill 0.35)  (1 unrouted)
  Top 0.254: U3.8 12.32,59.31 | 12.32,59.31 12.19,59.31 11.81,59.69 | 11.81,59.69 11.81,62.19 C12.1 | 12.32,59.31 v11.43,58.42 | R4.2 30.61,62.46 | 30.61,62.46 R5.2 R3.2 | C13.1 5.59,42.84 5.59,44.45 | 5.59,44.45 J4.7 | 10.67,44.45 10.67,42.84 C14.1 9.74,41.49 7.49,39.24 J9.4 | 10.67,44.45 J4.5 | C15.1 15.75,42.84 15.75,44.45 | 15.75,44.45 J4.3 | C16.1 20.83,42.84 20.83,44.45 | 20.83,44.45 J4.1 | 10.67,44.45 5.59,44.45 | 10.67,44.45 15.75,44.45 | 15.75,44.45 20.83,44.45 | v30.48,64.01 30.48,62.59 30.61,62.46 | J3.10 65.91,41.78 62.23,38.1 62.23,36.83 60.96,35.56 49.53,35.56 48.26,36.83 48.26,38.1 44.7,41.66 33.27,41.66 33.02,41.91 33.02,49.44 PCB1.P$1 | U3.1 10.16,60.3 10.26,60.3 11.2,60.3 11.81,59.69
  Bottom 0.254: v11.43,58.42 12.7,57.15 24.13,57.15 | PCB1.P$1 29.21,53.25 29.21,57.15 | 24.13,57.15 29.21,57.15 | J4.1 20.83,53.85 24.13,57.15 | 29.21,57.15 29.21,62.23 30.48,63.5 v30.48,64.01
PI_4.4_ON
  Top 0.152: U1.14 58.42,31.75 58.88,31.29 69.67,31.29 71.12,29.84 71.12,28.45 | 71.12,28.45 70.51,28.45 IC1.4 | 71.12,28.45 71.73,28.45 IC1.3
PI_5V
  Top 0.254: U1.16 61.81,33.02 C3.1
  Top 0.508: X3.9 65.41,16.51 IC1.9 64.87,22.86 63.5,22.86 C1.1 63.92,24.13 76.2,24.13 80.01,27.94 C7.+ | IC2.9 50.06,22.33 49.53,22.86 49.53,24.13 | 49.53,24.13 C2.1 | 49.53,24.13 48.89,23.5 IC3.7 43.81,23.5 43.18,22.86 | 43.18,22.86 43.18,16.51 43.81,15.88 IC3.1 45.24,12.89 C4.1 57.02,12.83 57.15,12.7 | 43.18,22.86 43.18,27.94 46.58,31.34 J5.4 47,34.71 C3.1 | J1.2 57.15,12.7 | 57.15,12.7 C8.+ C10.+ C9.+ | K1.1 20.95,37.47 22.86,39.37 25.4,39.37 27.71,41.68 30.25,41.68 30.25,42.95 X5.5 | PCB1.P$4 35.87,55.88 48.26,55.88 50.8,58.42 J6.1 53.34,63.5 60.96,63.5 62.23,62.23 J7.1
  Top 2.54: PCB1.P$4 PCB1.P$2 27.84,57.15 24.13,57.15 21.59,54.61 21.59,50.33 30.25,41.68 32.55,39.37 43.18,39.37 46.58,35.97 J5.4
  Bottom 0.508: J1.2 J1.1 59.82,16.38 X3.9 X3.8
PI_6.3_ON
  Top 0.152: IC1.7 66.68,29.97 65.99,30.66 56.21,30.66 55.88,30.99 U1.12
PI_AC_CTRL  (via drill 0.35)
  Top 0.254: v52.7,30.23 IC2.7
  Bottom 0.254: PCB1.P$29 62.61,47.07 62.61,41.27 52.7,31.37 v52.7,30.23
PI_GND  (via drill 0.35)
  Top 0.254: U1.8 v52.07,39.5 | R1.1 v16.26,61.98 | R7.1 v6.1,61.98 | R6.1 v9.91,53.98 | R2.1 v12.45,53.98 | U3.3 v10.29,59.31 | C12.2 13.55,63.33 v13.59,63.37 | C16.2 v16.51,41.91 | C15.2 v11.43,41.91 | C14.2 v6.35,41.91 | C13.2 v1.27,41.91 | C18.2 v17.4,52.32 | C19.2 v5.08,52.32 | C20.2 v6.35,63.5 | C17.2 v24.13,60.96
  Top 0.508: IC2.8 v51.44,30.1 | IC1.8 v65.41,26.16 | C1.2 v63.5,27.43 | C3.2 v63.5,37.72 | C2.2 49.66,26.38 v49.66,27.56 | IC3.8 v47.24,24.77 | IC3.2 v47.12,17.14 | C4.2 v42.29,12.83 | K2.2 v65.15,59.69
  Bottom 0.254: v17.4,52.32 17.53,52.32 17.78,52.07 | v5.08,52.32 5.08,52.07
  pour Bottom (rank 2): 0.89,67.31 90.17,67.31 90.17,0 0.89,0
PI_I2S_BCLK
  Top 0.254: PCB1.P$12 44.98,53.77 46.02,54.81 72.82,54.81 73.15,54.48 73.15,48.64 74.93,46.86 J3.5
PI_I2S_DATA
  Bottom 0.254: J3.7 72.39,46.99 73.66,48.26 74.28,48.26 arc-90 74.6,47.94 74.6,46.86 arc90 74.91,46.54 75.01,46.54 arc90 75.32,46.86 75.32,49.66 arc-90 75.64,49.98 75.73,49.98 arc-90 76.05,49.66 76.05,46.86 arc90 76.37,46.54 76.46,46.54 arc90 76.78,46.86 76.78,49.66 arc-90 77.1,49.98 77.19,49.98 arc-90 77.51,49.66 77.51,46.86 arc90 77.83,46.54 77.92,46.54 arc90 78.24,46.86 78.24,49.66 arc-90 78.55,49.98 78.65,49.98 arc-90 78.96,49.66 78.96,46.86 arc90 79.28,46.54 79.38,46.54 arc90 79.69,46.86 79.69,47.94 arc-90 80.01,48.26 81.28,49.53 81.28,53.34 80.85,53.77 PCB1.P$40
PI_I2S_LRCK
  Top 0.254: J3.3 78.04,45.15 arc90 78.04,45.6 77.03,46.61 arc-90 77.03,47.06 77.06,47.09 arc-90 77.51,47.09 78.52,46.08 arc90 78.97,46.08 79,46.11 arc90 79,46.55 77.99,47.57 arc-90 77.99,48.02 78.02,48.05 arc-90 78.47,48.05 79.48,47.03 arc90 79.93,47.03 79.96,47.06 arc90 79.96,47.51 78.94,48.52 arc-90 78.94,48.97 78.97,49 arc-90 79.42,49 80.43,47.99 arc90 80.88,47.99 81.28,48.39 81.28,54.61 80.01,55.88 arc-90 79.69,56.2 79.69,56.83 arc90 79.38,57.15 79.32,57.15 arc90 79.01,56.83 79.01,56.2 arc-90 78.69,55.88 78.64,55.88 arc-90 78.32,56.2 78.32,56.83 arc90 78,57.15 77.95,57.15 arc90 77.64,56.83 77.64,56.2 arc-90 77.32,55.88 77.27,55.88 arc-90 76.95,56.2 76.95,56.83 arc90 76.63,57.15 76.58,57.15 arc90 76.26,56.83 76.26,56.2 arc-90 75.95,55.88 75.57,55.5 75.57,51.56 75.23,51.23 PCB1.P$35
PI_LINE_RCA_ON
  Top 0.152: 57.66,28.6 57.66,29.34 57.78,29.46 57.28,29.97 53.98,29.97 53.34,30.61 U1.10
  Top 0.254: 57.66,28.6 IC2.3
PI_LINE_XLR_ON
  Top 0.152: U1.11 54.61,30.99 55.24,30.35 59.05,30.35 59.69,29.72 59.69,28.45 | 59.69,28.45 59.08,28.45 | 59.69,28.45 60.3,28.45
  Top 0.254: 59.08,28.45 IC2.2 | 60.3,28.45 IC2.1
PI_RX
  Top 0.254: PCB1.P$33 71.88,51.21 71.88,50.8 arc90 72.2,50.48 72.3,50.48 arc-90 72.62,50.16 72.62,50.03 arc-90 72.3,49.71 71.46,49.71 arc90 71.14,49.39 71.14,49.26 arc90 71.46,48.94 72.3,48.94 arc-90 72.62,48.62 72.62,48.48 arc-90 72.3,48.17 71.46,48.17 arc90 71.14,47.85 71.14,47.71 arc90 71.46,47.39 72.3,47.39 arc-90 72.62,47.08 72.62,46.94 arc-90 72.3,46.62 72.2,46.62 arc90 71.88,46.3 71.88,46.23 71.17,45.52 71.17,44.07 71.89,43.36 78.44,43.36 J3.2
PI_RX2  (via drill 0.35)
  Top 0.254: v47.24,22.23 IC3.6 | PCB1.P$10 42.67,52.48 42.67,48.9 45.97,45.59 v45.85,45.59
  Bottom 0.254: v45.85,45.59 45.85,38.86 48.51,36.2 48.51,23.5 v47.24,22.23
PI_TX
  Top 0.254: PCB1.P$32 70.61,52.48 70.61,49.53 68.07,46.99 68.07,44.32 69.09,43.31 70.74,43.31 71.12,42.93 71.12,40.89 71.76,40.26 75.44,40.26 76.96,41.78 J3.4
PI_TX2  (via drill 0.35)
  Top 0.254: v47.24,20.95 IC3.5 | PCB1.P$8 39.88,52.73 39.88,48.26 41.27,46.86 43.31,46.86 44.58,45.59 v44.58,45.47
  Bottom 0.254: v44.58,45.47 44.58,21.97 45.59,20.95 v47.24,20.95
PI_XLR_ON
  Top 0.152: U1.15 59.69,32 60.07,31.62 72.01,31.62 73.66,29.97 73.66,28.45 | 73.66,28.45 73.05,28.45 IC1.2 | 73.66,28.45 74.27,28.45 IC1.1
RELAY_EN
  Top 0.254: PCB1.P$16 49,53.7 47.75,52.45 47.75,50.29 46.99,49.53 46.99,42.6 49.36,40.23 52.07,40.23 52.66,40.23 53.75,40.23 54.61,39.37 U1.6
RELAY_SE0
  Top 0.254: U1.1 60.96,39.5 62.99,41.53 62.99,52.53 PCB1.P$28
RELAY_SE1  (via drill 0.35)
  Top 0.254: U1.2 59.69,48.26 60.58,49.15 v60.58,49.66
  Bottom 0.254: v60.58,49.66 60.58,54.36 59.69,55.24 57.15,55.24 56.62,54.71 PCB1.P$22
RELAY_SE2
  Top 0.254: U1.3 58.42,39.37 55.88,41.91 50.29,41.91 49.53,42.67 49.53,48.77 50.29,49.53 50.29,52.53 PCB1.P$18
TEMP_ALARM  (via drill 0.35)
  Top 0.254: U3.2 8.23,59.82 7.62,60.42 7.62,62.23 9.42,64.03 13.86,64.03 13.88,64.01 24.2,64.01 26.84,61.37 33.76,61.37 35.61,59.51 R3.1 v35.56,57.78 | U1.5 55.88,36.32 55.75,36.2 50.74,36.2 48.67,38.27 48.67,39.54 45.89,42.32 36.04,42.32 35.56,42.8 35.56,47.88 37.59,49.91 v37.59,52.45
  Bottom 0.254: v35.56,57.78 37.59,55.75 v37.59,52.45
USB_MODE  (via drill 0.35)
  Top 0.508: v68.58,60.96 67.31,62.23 K2.1
  Bottom 0.254: PCB1.P$15 49,51.66 50.42,53.09 50.42,54.61 51.44,55.63 55.12,55.63 56.26,56.77 67.18,56.77 68.58,58.17 v68.58,60.96
XLRL_ON
  Top 0.254: IC1.16 74.3,21.59 74.93,20.95 82.55,20.95 85.6,17.91 X3.1
XLRR_ON
  Top 0.254: IC1.15 73.03,20.95 73.66,20.32 79.12,20.32 X3.2

### Text on the board
tPlace: ENCODER | IR | 10K | I2C | 10K | ADS1015 | 5V A B SW GND | 5V RX GND | CPC1017N | USB MODE | N0 3.3V N1 3.3V N2 3.3V N3 3.3V | 5V CS SDI SCLK GND | ALM CS SCLK SDI SDO GND | SEL DATA BCLK LRCK GND | 10K NTC | PGA | ADC | 3.3V / SDA / SCL / GND | LCD_GND LCD_5V PI_GND PI_5V | EN / TMP / DC / S2 / S1 / S0 | PI/LCD POWER | POWER_BOARD | 3.3V GND AC TX RX | 74HC238 | RCA / XLR / 6.3 / 2.5 / 4.4 / XLR | SI8641 | +18V 0V +18V 0V | LCD Serial | TPL7407LAD | 6.3 2.5 4.4 XLR | 5V / RST / CTS / TX / RX / RTS / GND / GND | LINE OUT RELAY | OUTPUT RELAY | KG Power Switch | Asus Tinker S / Control Board | Power / Switch | EMMC / Disable